# Altium project vme6U_carrier_Cyc_V_SoC.PrjPcb (part 3 of 8)

## Sheet ethernet_1gbe_ext_magn.SchDoc
size A4
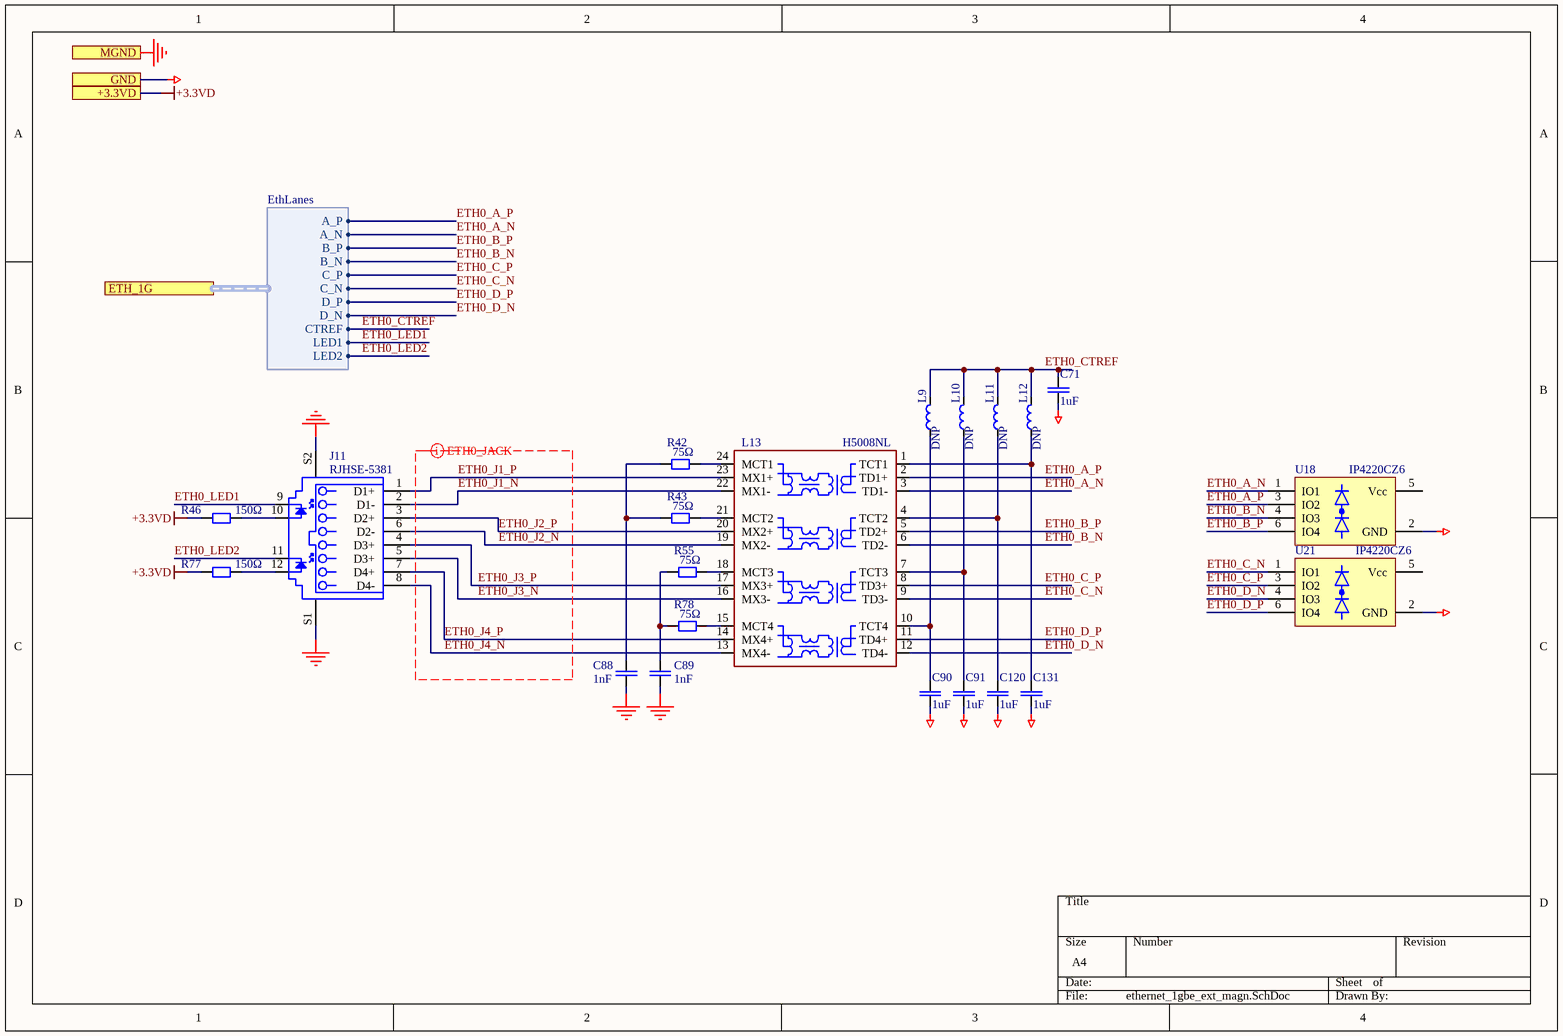
[diagram p4: ethernet_1gbe_ext_magn.SchDoc]

### Parts
(Parts that share a designator on the sheet are numbered #1, #2 ... from top to bottom, then left to right.)
C71  1uF  [CAPC2012N]
C88#1  value 1nF  [CAPC3216N]  (hidden comment: 1nF; 2kV)
C89  value 1nF  [CAPC3216N]  (hidden comment: 1nF; 2kV)
C90  1uF  [CAPC2012N]
C91#1  1uF  [CAPC2012N]
C120#1  1uF  [CAPC2012N]
C131  1uF  [CAPC2012N]
J11  RJHSE-5381  [AMPH-RJHSE-5381_V]
L9  DNP  [INDC2012N]
L10  DNP  [INDC2012N]
L11  DNP  [INDC2012N]
L12  DNP  [INDC2012N]
L13  H5008NL  [SMD_HX508]
R42  75Ω  [RESC2012N]
R43  75Ω  [RESC2012N]
R46  150Ω  [RESC2012N]
R55  75Ω  [RESC2012N]
R77  150Ω  [RESC2012N]
R78#1  75Ω  [RESC2012N]
U18  IP4220CZ6  [SOT95P285X110-6N]
U21#1  IP4220CZ6  [SOT95P285X110-6N]

### Ports
+3.3VD, ETH_1G (harness EthLanes), GND, MGND

### Harnesses
EthLanes: A_P, A_N, B_P, B_N, C_P, C_N, D_P, D_N, LED1, LED2, CTREF

### Nets
+3.3VD: R46.1 R77.1 ; port +3.3VD
GND: C71.1 C90.1 C91#1.1 C120#1.1 C131.1 U18.2(GND) U21#1.2(GND) ; port GND  [project net POK_int]
MGND: C88#1.1 C89.1 J11.S1 J11.S2 ; port MGND
ETH0_A_N: L13.3(TD1-) U18.1(IO1) ; port ETH_1G.A_N
ETH0_A_P: L13.2(TD1+) U18.3(IO2) ; port ETH_1G.A_P
ETH0_B_N: L13.6(TD2-) U18.4(IO3) ; port ETH_1G.B_N
ETH0_B_P: L13.5(TD2+) U18.6(IO4) ; port ETH_1G.B_P
ETH0_C_N: L13.9(TD3-) U21#1.1(IO1) ; port ETH_1G.C_N
ETH0_C_P: L13.8(TD3+) U21#1.3(IO2) ; port ETH_1G.C_P
ETH0_CTREF: C71.2 L9.2 L10.2 L11.2 L12.2 ; port ETH_1G.CTREF
ETH0_D_N: L13.12(TD4-) U21#1.4(IO3) ; port ETH_1G.D_N
ETH0_D_P: L13.11(TD4+) U21#1.6(IO4) ; port ETH_1G.D_P
ETH0_J1_N: J11.2(D1-) L13.22(MX1-)
ETH0_J1_P: J11.1(D1+) L13.23(MX1+)
ETH0_J2_N: J11.6(D2-) L13.19(MX2-)
ETH0_J2_P: J11.3(D2+) L13.20(MX2+)
ETH0_J3_N: J11.5(D3+) L13.16(MX3-)
ETH0_J3_P: J11.4(D3+) L13.17(MX3+)
ETH0_J4_N: J11.8(D4-) L13.13(MX4-)
ETH0_J4_P: J11.7(D4+) L13.14(MX4+)
ETH0_LED1: J11.9 ; port ETH_1G.LED1
ETH0_LED2: J11.11 ; port ETH_1G.LED2
NetC88#1_2: C88#1.2 R42.1 R43.1
NetC89_2: C89.2 R55.1 R78#1.1
NetC90_2: C90.2 L9.1 L13.10(TCT4)
NetC91#1_2: C91#1.2 L10.1 L13.7(TCT3)
NetC120#1_2: C120#1.2 L11.1 L13.4(TCT2)
NetC131_2: C131.2 L12.1 L13.1(TCT1)
NetJ11_10: J11.10 R46.2
NetJ11_12: J11.12 R77.2
NetL13_15: L13.15(MCT4) R78#1.2
NetL13_18: L13.18(MCT3) R55.2
NetL13_21: L13.21(MCT2) R43.2
NetL13_24: L13.24(MCT1) R42.2

Not connected (* = marked no-connect by the designer): U18 5(Vcc); U21#1 5(Vcc)

### Layout directives
differential pair; rule Differential Pairs Routing [Pref Gap = 0.254mm    Min Gap  = 0.075mm    Max Gap  = 0.254mmPref Width = 0.3mm    Min Width  = 0.075mm    Max Width  = 0.5mm]: ETH0_J1_N, ETH0_J1_P, ETH0_J2_N, ETH0_J2_P, ETH0_J3_N, ETH0_J3_P, ETH0_J4_N, ETH0_J4_P

### Library data of the parts
C71 C90 C91#1 C120#1 C131 = CAPC: Generic ceramic SMD capacitor; Pkg: 0805; Maintainer: Evgeniy Kotov; SMD Solders: 2; THD Solders: 0; Voltage Rating: 10V; PartField: 1uF; Last Change Data: 06.03.2017; Release Date: 06.03.2017; Value: 1uF
C88#1 = CAPC: Generic ceramic SMD capacitor / +' x '+Voltage Rating; Pkg: 1206; Maintainer: Evgeniy Kotov; SMD Solders: 2; THD Solders: 0; PartField: 1nF; Last Change Data: 06.03.2017; Release Date: 06.03.2017; VoltageRating: 2kV
C89 = CAPC: Generic ceramic SMD capacitor; Pkg: 1206; Maintainer: Evgeniy Kotov; SMD Solders: 2; THD Solders: 0; PartField: 1nF; Last Change Data: 06.03.2017; Release Date: 06.03.2017; VoltageRating: 2kV
J11 = RJ45-RJHSE-5381: High Speed RJ45, Modular Jack, 8 Position, 8 Contacts, Shielded, with LEDs, -55 to 85 degC,12-Pin THD, RoHS, Tray; Manufacturer: Amphenol; Number of Positions/Contacts: 8p8c(RJ45,Ethernet); Number of Ports: 1; Catalog Drawings: RJ45SeriesRightAngle; PCN Design/Specification: MultipleSeriesCopper29/Jan/2009RJHSEShieldMaterial30/Jun/2015; Other Names: RJHSE5381; Online Catalog: RJHSESeries; Featured Product: ModularJacksProductSolutions; Tab Direction: Up; Shielding: Shielded,EMIFinger; LED Color: Yellow-Green; 3D Model: RJHSE538x.stpRJHSE538x.igs; Pkg: LAN conn; SMD Solders: 0; THD Solders: 14; Category: Connectors,Interconnects; Termination: Solder; Housing Material: Thermoplastic; Mounting Type: ThroughHole; Family: ModularConnectors-Jacks; Orientation: 90°Angle(Right); Features: BoardLock; Contact Material: PhosphorBronze; Mounting Technology: ThroughHole; Number of Rows: 1; Standard Package: 120; Ratings: -; Operating Temperature: -55°C~85°C; Series: RJHSE; Contact Finish: Gold; Package Reference: RJHSE-5381; Ingress Protection: -; Package Description: 12-Pin Through Hole Device, Body 16.51 x 15.75 mm; Contact Finish Thickness: 50µin(1.27µm); Datasheet URL: https://datasheet.ciiva.com/16481/rjhse538x-16481714.pdf; Datasheet Version: Rev. K, 04/2014; Connector Type: Jack; Manufacturer URL: http://www.amphenol.com/; Packaging: Tray; PartField: RJHSE-5381; Value: RJHSE-5381
L9-L12 = BLM21RK102SN1D: Ferrite Beads, 0805, 1 kOhm; Pkg: 0805; Vendor: Murata; Maintainer: Evgeniy Kotov; SMD Solders: 2; THD Solders: 0; DC Current: 200mA; Tolerance: 25%; DC Resistance: 500mΩ; PartField: BLM21RK102SN1D; Release Date: 30.03.2017; Last Change Data: 30.03.2017; Temperature Range: -55°C to +125°C; Value: DNP
L13 = LAN_1G_TR_H5008NL: LAN Transformer fog 1GbE, 12 coils, 4 pairs.; Vendor: Pulse Electronics; Maintainer: Evgeniy Kotov; SMD Solders: 2; THD Solders: 0; Tolerance: 2%; PartField: H5008NL; Pkg: H5008NL; Release Date: 31.03.2017; Last Change Data: 31.03.2017; Temperature Range: -25°C to +85°C; Value: H5008NL
R42 R43 R46 R55 R77 R78#1 = RESC: Resistor, Generic, SMD; Pkg: 0805; Maintainer: Evgeniy Kotov; SMD Solders: 2; THD Solders: 0; Release Date: 06.03.2017; Last Change Data: 09.03.2017
  R42 R43 R55 R78#1: PartField: 75Ω; Value: 75Ω
  R46 R77: PartField: 150Ω; Value: 150Ω
U18 U21#1 = IP4220CZ6: Transimpedance Amplifier; Selectable-Feedback Resistance; Pkg: SOT457; SMD Solders: 6; THD Solders: 0; Maintainer: Evgeniy Kotov; Vendor: NXP; PartField: IP4220CZ6; ComponentLink1URL: http://assets.nexperia.com/documents/data-sheet/IP4220CZ6.pdf; ComponentLink1Description: Datasheet; Last Change Date: 28.03.2017; Release Date: 28.03.2017; Value: IP4220CZ6

## Sheet ethernet_dual_100mbe_ext_magn.SchDoc
size A4
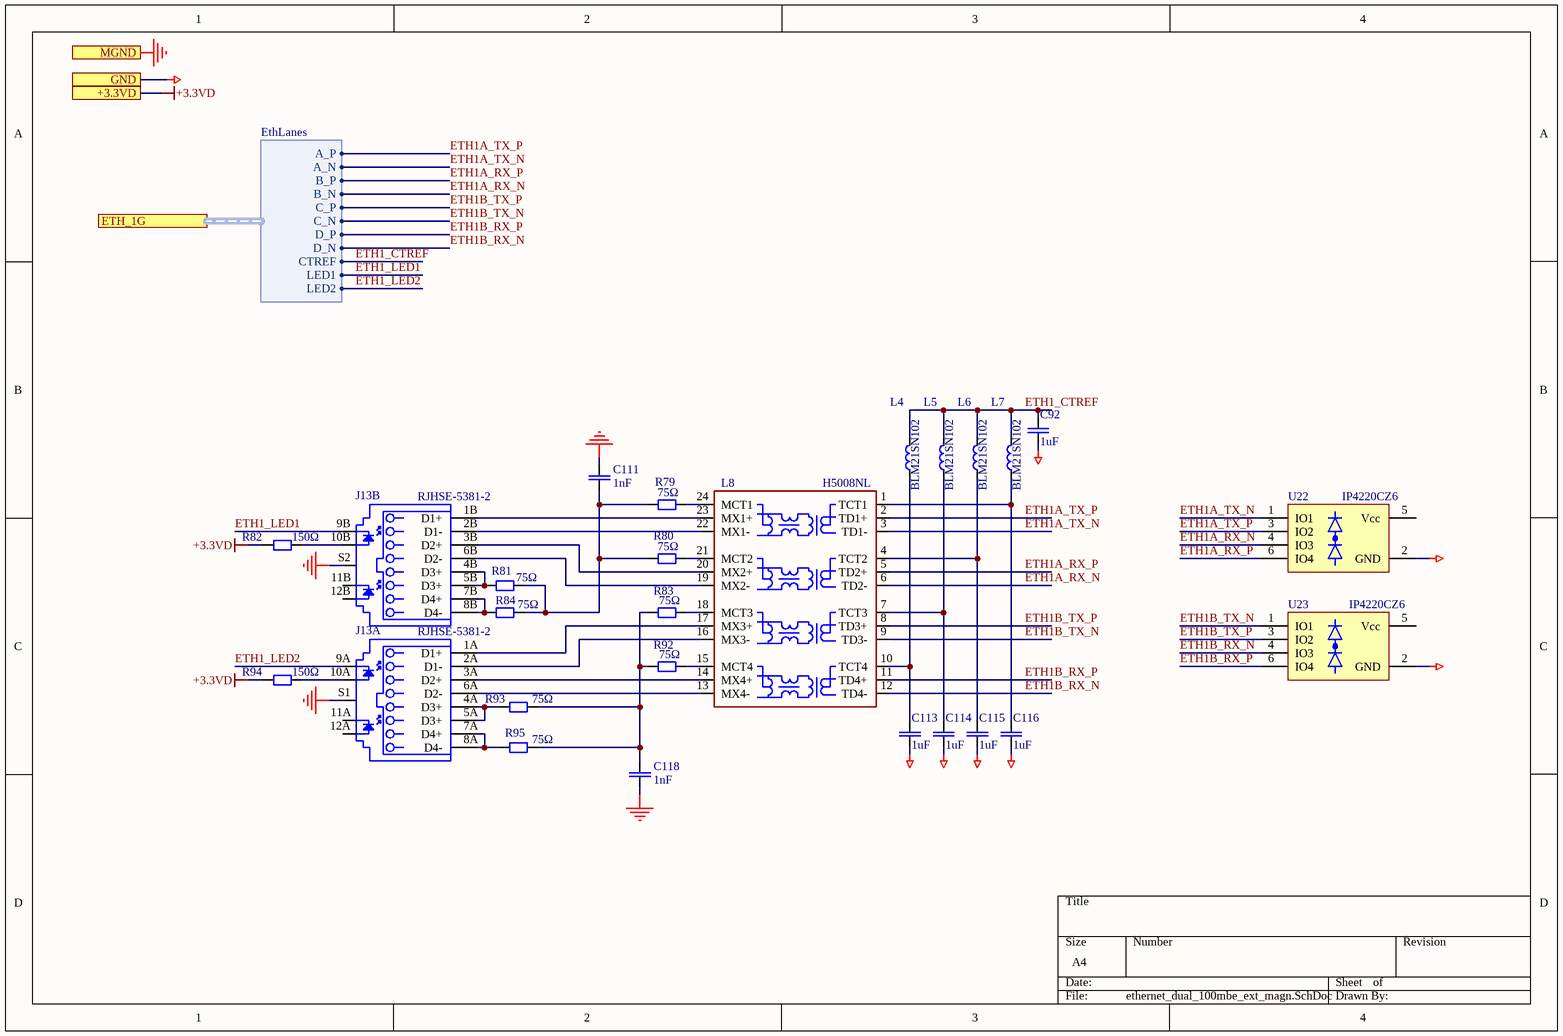
[diagram p5: ethernet_dual_100mbe_ext_magn.SchDoc]

### Parts
(Parts that share a designator on the sheet are numbered #1, #2 ... from top to bottom, then left to right.)
C92  1uF  [CAPC2012N]
C111  value 1nF  [CAPC3216N]  (hidden comment: 1nF; 2kV)
C113  1uF  [CAPC2012N]
C114  1uF  [CAPC2012N]
C115  1uF  [CAPC2012N]
C116  1uF  [CAPC2012N]
C118  value 1nF  [CAPC3216N]  (hidden comment: 1nF; 2kV)
J13  RJHSE-5381-2  [AMPH-RJHSE-5381-02_V]  (parts A,B of 2)
L4  value BLM21SN102  [INDC2012N]  (hidden comment: BLM21RK102SN1D)
L5  value BLM21SN102  [INDC2012N]  (hidden comment: BLM21RK102SN1D)
L6  value BLM21SN102  [INDC2012N]  (hidden comment: BLM21RK102SN1D)
L7  value BLM21SN102  [INDC2012N]  (hidden comment: BLM21RK102SN1D)
L8  H5008NL  [SMD_HX508]
R79  75Ω  [RESC2012N]
R80#1  75Ω  [RESC2012N]
R81  75Ω  [RESC2012N]
R82#1  150Ω  [RESC2012N]
R83#1  75Ω  [RESC2012N]
R84  75Ω  [RESC2012N]
R92#1  75Ω  [RESC2012N]
R93  75Ω  [RESC2012N]
R94  150Ω  [RESC2012N]
R95  75Ω  [RESC2012N]
U22  IP4220CZ6  [SOT95P285X110-6N]
U23  IP4220CZ6  [SOT95P285X110-6N]

### Ports
+3.3VD, ETH_1G (harness EthLanes), GND, MGND

### Harnesses
EthLanes: A_P, A_N, B_P, B_N, C_P, C_N, D_P, D_N, LED1, LED2, CTREF

### Nets
+3.3VD: R82#1.1 R94.1 ; port +3.3VD
GND: C92.1 C113.1 C114.1 C115.1 C116.1 U22.2(GND) U23.2(GND) ; port GND  [project net POK_int]
MGND: C111.2 C118.1 J13.S1 J13.S2 ; port MGND
ETH1_CTREF: C92.2 L4.2 L5.2 L6.2 L7.2 ; port ETH_1G.CTREF
ETH1_LED1: J13.9B ; port ETH_1G.LED1
ETH1_LED2: J13.9A ; port ETH_1G.LED2
ETH1A_RX_N: L8.6(TD2-) U22.4(IO3) ; port ETH_1G.B_N
ETH1A_RX_P: L8.5(TD2+) U22.6(IO4) ; port ETH_1G.B_P
ETH1A_TX_N: L8.3(TD1-) U22.1(IO1) ; port ETH_1G.A_N
ETH1A_TX_P: L8.2(TD1+) U22.3(IO2) ; port ETH_1G.A_P
ETH1B_RX_N: L8.12(TD4-) U23.4(IO3) ; port ETH_1G.D_N
ETH1B_RX_P: L8.11(TD4+) U23.6(IO4) ; port ETH_1G.D_P
ETH1B_TX_N: L8.9(TD3-) U23.1(IO1) ; port ETH_1G.C_N
ETH1B_TX_P: L8.8(TD3+) U23.3(IO2) ; port ETH_1G.C_P
NetC111_1: C111.1 R79.1 R80#1.1 R81.2 R84.2
NetC113_2: C113.2 L4.1 L8.10(TCT4)
NetC114_2: C114.2 L5.1 L8.7(TCT3)
NetC115_2: C115.2 L6.1 L8.4(TCT2)
NetC116_2: C116.2 L7.1 L8.1(TCT1)
NetC118_2: C118.2 R83#1.1 R92#1.1 R93.2 R95.2
NetJ13_1A: J13.1A(D1+) L8.17(MX3+)
NetJ13_1B: J13.1B(D1+) L8.23(MX1+)
NetJ13_2A: J13.2A(D1-) L8.16(MX3-)
NetJ13_2B: J13.2B(D1-) L8.22(MX1-)
NetJ13_3A: J13.3A(D2+) L8.14(MX4+)
NetJ13_3B: J13.3B(D2+) L8.20(MX2+)
NetJ13_4A: J13.4A(D3+) J13.5A(D3+) R93.1
NetJ13_4B: J13.4B(D3+) J13.5B(D3+) R81.1
NetJ13_6A: J13.6A(D2-) L8.13(MX4-)
NetJ13_6B: J13.6B(D2-) L8.19(MX2-)
NetJ13_7A: J13.7A(D4+) J13.8A(D4-) R95.1
NetJ13_7B: J13.7B(D4+) J13.8B(D4-) R84.1
NetJ13_10A: J13.10A R94.2
NetJ13_10B: J13.10B R82#1.2
NetL8_15: L8.15(MCT4) R92#1.2
NetL8_18: L8.18(MCT3) R83#1.2
NetL8_21: L8.21(MCT2) R80#1.2
NetL8_24: L8.24(MCT1) R79.2

Not connected (* = marked no-connect by the designer): J13 11A(11) 11B(11) 12A(12) 12B(12); U22 5(Vcc); U23 5(Vcc)

### Library data of the parts
C92 C113-C116 = CAPC: as C71 on sheet ethernet_1gbe_ext_magn; PartField: 1uF; Last Change Data: 06.03.2017; Release Date: 06.03.2017; Value: 1uF
C111 C118 = CAPC: as C89 on sheet ethernet_1gbe_ext_magn; PartField: 1nF; Last Change Data: 06.03.2017; Release Date: 06.03.2017; VoltageRating: 2kV
J13 = RJ45-RJHSE-5381-2: Dual Port, High Speed RJ45, Modular Jack, 8 Position, 8 Contacts, Shielded, with LEDs, -55 to 85 degC,12-Pin THD, RoHS, Tray; Manufacturer: Amphenol; Number of Positions/Contacts: 8p8c(RJ45,Ethernet); Number of Ports: 1; Catalog Drawings: RJ45SeriesRightAngle; PCN Design/Specification: MultipleSeriesCopper29/Jan/2009RJHSEShieldMaterial30/Jun/2015; Other Names: RJHSE5381; Online Catalog: RJHSESeries; Featured Product: ModularJacksProductSolutions; Tab Direction: Up; Shielding: Shielded,EMIFinger; LED Color: Yellow-Green; 3D Model: RJHSE538x.stpRJHSE538x.igs; Pkg: LAN x2; SMD Solders: 0; THD Solders: 28; Category: Connectors,Interconnects; Termination: Solder; Housing Material: Thermoplastic; Mounting Type: ThroughHole; Family: ModularConnectors-Jacks; Orientation: 90°Angle(Right); Features: BoardLock; Contact Material: PhosphorBronze; Mounting Technology: ThroughHole; Number of Rows: 1; Standard Package: 120; Ratings: -; Operating Temperature: -55°C~85°C; Series: RJHSE; Contact Finish: Gold; Package Reference: RJHSE-5381; Ingress Protection: -; Package Description: 12-Pin Through Hole Device, Body 16.51 x 15.75 mm; Contact Finish Thickness: 50µin(1.27µm); Datasheet URL: https://datasheet.ciiva.com/16481/rjhse538x-16481714.pdf; Datasheet Version: Rev. K, 04/2014; Connector Type: Jack; Manufacturer URL: http://www.amphenol.com/; Packaging: Tray; PartField: RJHSE-5381-2; Value: RJHSE-5381-2
L4-L7 = BLM21RK102SN1D: as L9 on sheet ethernet_1gbe_ext_magn; PartField: BLM21RK102SN1D; Release Date: 30.03.2017; Last Change Data: 30.03.2017; Temperature Range: -55°C to +125°C
L8 = LAN_1G_TR_H5008NL: as L13 on sheet ethernet_1gbe_ext_magn; PartField: H5008NL; Pkg: H5008NL; Release Date: 31.03.2017; Last Change Data: 31.03.2017; Temperature Range: -25°C to +85°C; Value: H5008NL
R79 R80#1 R81 R82#1 R83#1 R84 R92#1 R93-R95 = RESC: as R42 on sheet ethernet_1gbe_ext_magn; Release Date: 06.03.2017; Last Change Data: 09.03.2017
  R79 R80#1 R81 R83#1 R84 R92#1 R93 R95: PartField: 75Ω; Value: 75Ω
  R82#1 R94: PartField: 150Ω; Value: 150Ω
U22 U23 = IP4220CZ6: as U18 on sheet ethernet_1gbe_ext_magn; PartField: IP4220CZ6; ComponentLink1URL: http://assets.nexperia.com/documents/data-sheet/IP4220CZ6.pdf; ComponentLink1Description: Datasheet; Last Change Date: 28.03.2017; Release Date: 28.03.2017; Value: IP4220CZ6

## Sheet uart_adm3222.SchDoc
size A4
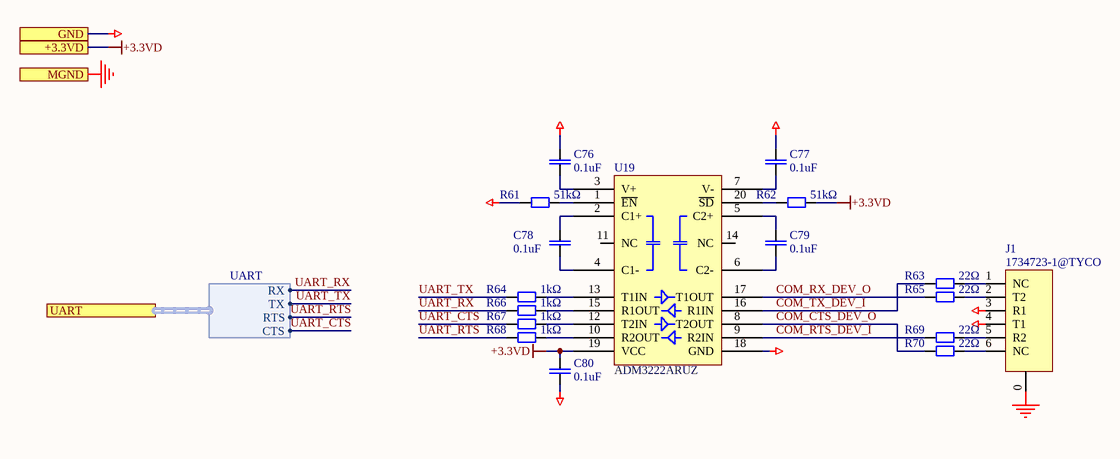
[diagram p6: uart_adm3222.SchDoc]

### Parts
(Parts that share a designator on the sheet are numbered #1, #2 ... from top to bottom, then left to right.)
C76#1  0.1uF  [CAPC2012N]
C77  0.1uF  [CAPC2012N]
C78  0.1uF  [CAPC2012N]
C79#1  0.1uF  [CAPC2012N]
C80  0.1uF  [CAPC2012N]
J1#1  1734723-1@TYCO  [RJ14]
R61  51kΩ  [RESC2012N]
R62  51kΩ  [RESC2012N]
R63  22Ω  [RESC1608N]
R64  1kΩ  [RESC2012N]
R65  22Ω  [RESC1608N]
R66  1kΩ  [RESC2012N]
R67#1  1kΩ  [RESC2012N]
R68  1kΩ  [RESC2012N]
R69  22Ω  [RESC1608N]
R70  22Ω  [RESC1608N]
U19#1  ADM3222ARUZ  [SOP65P640X110-20N]

### Ports
+3.3VD, GND, MGND, UART (harness UART)

### Harnesses
UART: RX, TX, RTS, CTS

### Nets
+3.3VD: C80.2 R62.2 U19#1.19(VCC) ; port +3.3VD
GND: C76#1.2 C77.2 C80.1 J1#1.3(R1) J1#1.4(T1) R61.1 U19#1.18(GND) ; port GND  [project net POK_int]
MGND: J1#1.0 ; port MGND
COM_CTS_DEV_O: R70.1 U19#1.8(T2OUT)
COM_RTS_DEV_I: R69.1 U19#1.9(R2IN)
COM_RX_DEV_O: R65.1 U19#1.17(T1OUT)
COM_TX_DEV_I: R63.1 U19#1.16(R1IN)
UART_CTS: R67#1.1 ; port UART.CTS
UART_RTS: R68.1 ; port UART.RTS
UART_RX: R66.1 ; port UART.RX
UART_TX: R64.1 ; port UART.TX
NetC76#1_1: C76#1.1 U19#1.3(V+)
NetC77_1: C77.1 U19#1.7(V-)
NetC78_1: C78.1 U19#1.4(C1-)
NetC78_2: C78.2 U19#1.2(C1+)
NetC79#1_1: C79#1.1 U19#1.6(C2-)
NetC79#1_2: C79#1.2 U19#1.5(C2+)
NetJ1#1_1: J1#1.1(NC) R63.2
NetJ1#1_2: J1#1.2(T2) R65.2
NetJ1#1_5: J1#1.5(R2) R69.2
NetJ1#1_6: J1#1.6(NC) R70.2
NetR61_2: R61.2 U19#1.1(~{EN})
NetR62_1: R62.1 U19#1.20(~{SD})
NetR64_2: R64.2 U19#1.13(T1IN)
NetR66_2: R66.2 U19#1.15(R1OUT)
NetR67#1_2: R67#1.2 U19#1.12(T2IN)
NetR68_2: R68.2 U19#1.10(R2OUT)

Not connected (* = marked no-connect by the designer): U19#1 11(NC) 14(NC)

### Library data of the parts
C76#1 C77 C78 C79#1 C80 = CAPC: Generic ceramic SMD capacitor; Pkg: 0805; Maintainer: Evgeniy Kotov; SMD Solders: 2; THD Solders: 0; PartField: 0.1uF; Last Change Data: 06.03.2017; Release Date: 06.03.2017; Value: 0.1uF
J1#1 = RJ-14: Pkg: RJ14-6p; SMD Solders: 0; THD Solders: 10; PartField: 1734723-1@TYCO; Value: 1734723-1@TYCO
R61 R62 R64 R66 R67#1 R68 = RESC: as R42 on sheet ethernet_1gbe_ext_magn; Release Date: 06.03.2017; Last Change Data: 09.03.2017
  R61 R62: PartField: 51kΩ; Value: 51kΩ
  R64 R66 R67#1 R68: PartField: 1kΩ; Value: 1kΩ
R63 R65 R69 R70 = RESC: Resistor, Generic, SMD; Pkg: 0603; Maintainer: Evgeniy Kotov; SMD Solders: 2; THD Solders: 0; PartField: 22Ω; Release Date: 06.03.2017; Last Change Data: 09.03.2017; Value: 22Ω
U19#1 = ADM3222ARU: RS232; Pkg: TSSOP-20; SMD Solders: 20; THD Solders: 0; Vendor: Analog Devices; ComponentLink1URL: https://www.analog.com/media/en/technical-documentation/data-sheets/ADM3202_3222_1385.pdf; Last Change Date: 24.05.2019; PartField: ADM3222ARUZ; Value: ADM3222

## Sheet jtag.SchDoc
size A4
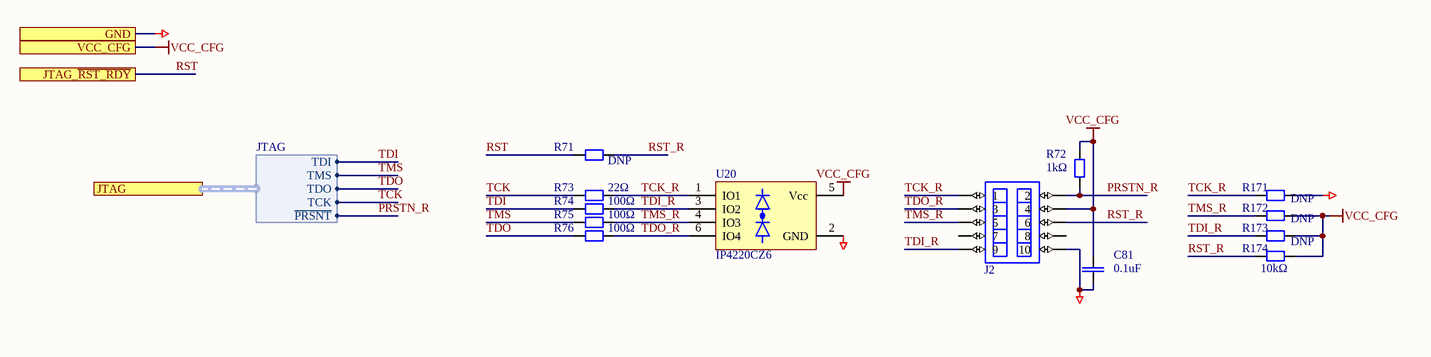
[diagram p7: jtag.SchDoc]

### Parts
(Parts that share a designator on the sheet are numbered #1, #2 ... from top to bottom, then left to right.)
C81#1  0.1uF  [CAPC2012N]
J2  IDC-10MC  [PLD-10]  (value not drawn)
R71  DNP  [RESC1608N]
R72  1kΩ  [RESC2012N]
R73  22Ω  [RESC1608N]
R74  100Ω  [RESC1608N]
R75  100Ω  [RESC1608N]
R76#1  100Ω  [RESC1608N]
R171  DNP  [RESC2012N]
R172  DNP  [RESC2012N]
R173#1  DNP  [RESC2012N]
R174  10kΩ  [RESC2012N]
U20  IP4220CZ6  [SOT95P285X110-6N]

### Ports
GND, JTAG (harness JTAG), JTAG_~{RST_RDY}, VCC_CFG

### Harnesses
JTAG: TDI, TMS, TDO, TCK, ~{PRSNT}

### Nets
GND: C81#1.1 J2.10 R171.2 U20.2(GND) ; port GND  [project net POK_int]
VCC_CFG: C81#1.2 J2.4 R72.2 R172.2 R173#1.2 R174.2 U20.5(Vcc) ; port VCC_CFG  [project net +3.3VD]
PRSTN_R: J2.2 R72.1 ; port JTAG.~{PRSNT}  [project net JTAG_~{PRSNT}]
RST: R71.1 ; port JTAG_~{RST_RDY}  [project net HPS_RSTn]
RST_R: J2.6 R71.2 R174.1
TCK: R73.1 ; port JTAG.TCK  [project net JTAG_TCK]
TCK_R: J2.1 R73.2 R171.1 U20.1(IO1)
TDI: R74.1 ; port JTAG.TDI  [project net JTAG_TDI]
TDI_R: J2.9 R74.2 R173#1.1 U20.3(IO2)
TDO: R76#1.1 ; port JTAG.TDO  [project net JTAG_TDO]
TDO_R: J2.3 R76#1.2 U20.6(IO4)
TMS: R75.1 ; port JTAG.TMS  [project net JTAG_TMS]
TMS_R: J2.5 R75.2 R172.1 U20.4(IO3)

Not connected (* = marked no-connect by the designer): J2 7 8

### Library data of the parts
C81#1 = CAPC: as C76#1 on sheet uart_adm3222; PartField: 0.1uF; Last Change Data: 06.03.2017; Release Date: 06.03.2017; Value: 0.1uF
J2 = IDC-10MS: Connector, 5x2, Male, 2.54mm Pitch, Strait contacts, with Body; SMD Solders: 0; THD Solders: 10; Maintainer: Evgeniy Kotov; Pkg: IDC-10; PartField: IDC-10MC; Last Change Data: 28.03.2017; Release Date: 28.03.2017; Value: IDC-10MC; ComponentLink1Description: Datasheet
R71 = RESC: Resistor, Generic, SMD; PartField: 100Ω; Pkg: 0603; Maintainer: Evgeniy Kotov; SMD Solders: 2; THD Solders: 0; Release Date: 06.03.2017; Last Change Data: 09.03.2017; Value: DNP
R72 R174 = RESC: as R42 on sheet ethernet_1gbe_ext_magn; Release Date: 06.03.2017; Last Change Data: 09.03.2017
  R72: PartField: 1kΩ; Value: 1kΩ
  R174: PartField: 10kΩ; Value: 10kΩ
R73-R75 R76#1 = RESC: as R63 on sheet uart_adm3222; Release Date: 06.03.2017; Last Change Data: 09.03.2017
  R73: PartField: 22Ω; Value: 22Ω
  R74 R75 R76#1: PartField: 100Ω; Value: 100Ω
R171 = RESC: Resistor, Generic, SMD; PartField: 1kΩ; Pkg: 0805; Maintainer: Evgeniy Kotov; SMD Solders: 2; THD Solders: 0; Release Date: 06.03.2017; Last Change Data: 09.03.2017; Value: DNP
R172 R173#1 = RESC: Resistor, Generic, SMD; PartField: 10kΩ; Pkg: 0805; Maintainer: Evgeniy Kotov; SMD Solders: 2; THD Solders: 0; Release Date: 06.03.2017; Last Change Data: 09.03.2017; Value: DNP
U20 = IP4220CZ6: as U18 on sheet ethernet_1gbe_ext_magn; PartField: IP4220CZ6; ComponentLink1URL: http://assets.nexperia.com/documents/data-sheet/IP4220CZ6.pdf; ComponentLink1Description: Datasheet; Last Change Date: 28.03.2017; Release Date: 28.03.2017; Value: IP4220CZ6

## Sheet sdcard_emmc.SchDoc
size A4
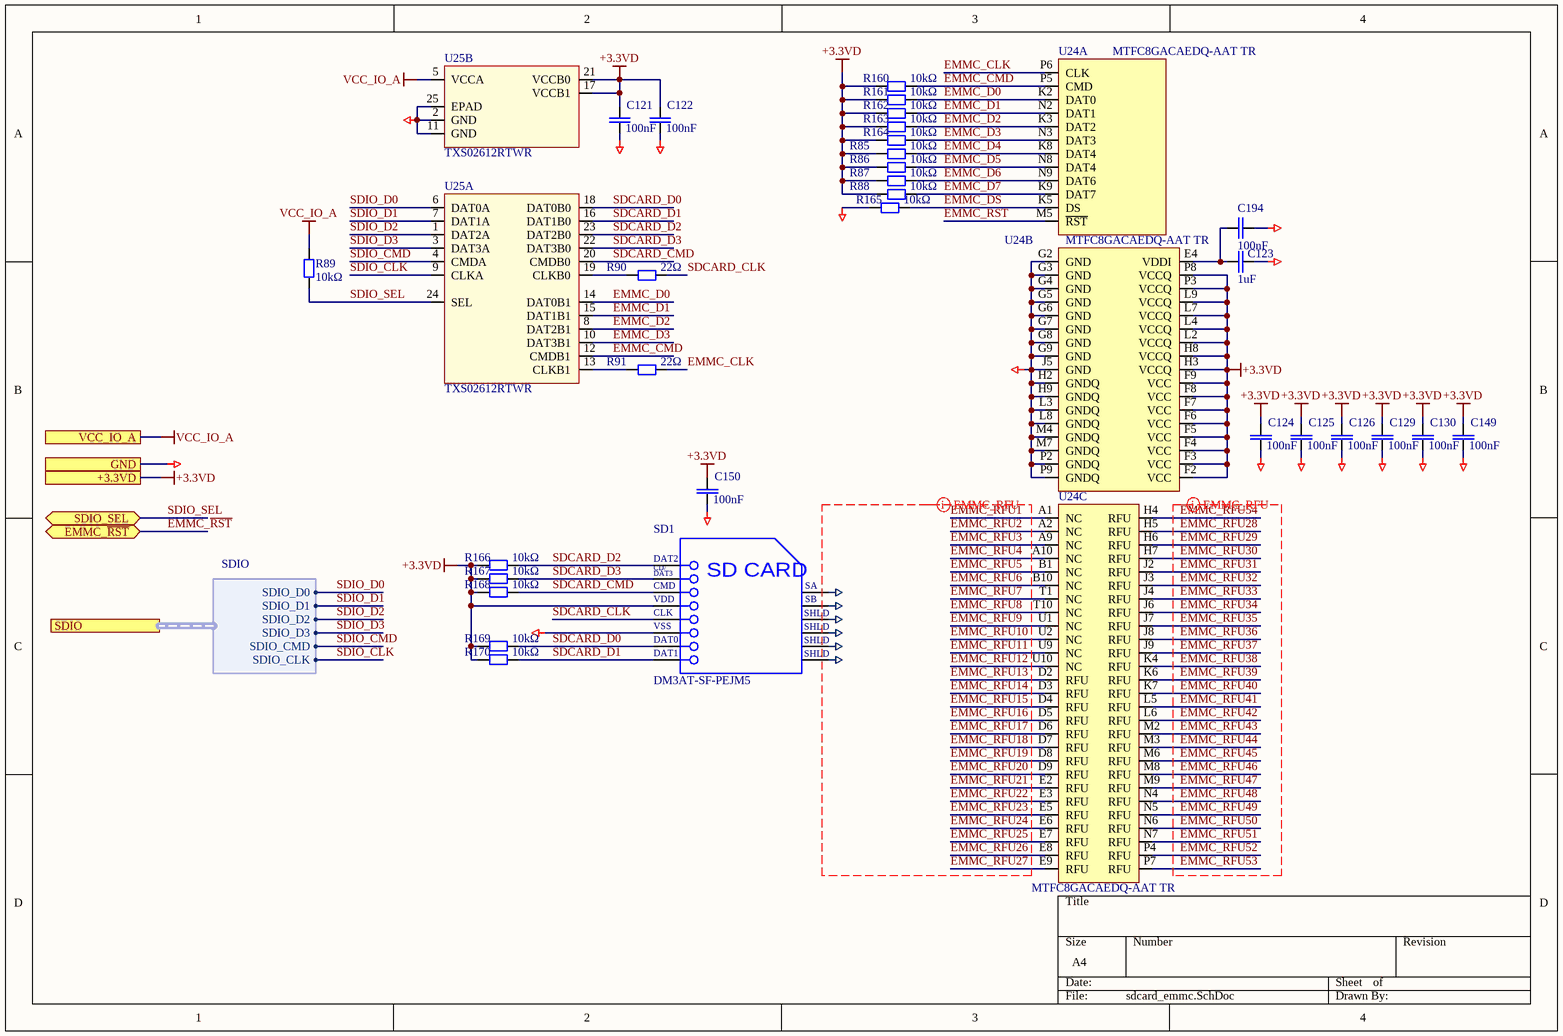
[diagram p8: sdcard_emmc.SchDoc]

### Parts
(Parts that share a designator on the sheet are numbered #1, #2 ... from top to bottom, then left to right.)
C121  100nF  [CAPC1608N]
C122#1  100nF  [CAPC1608N]
C123  1uF  [CAPC2012N]
C124  100nF  [CAPC1608N]
C125#1  100nF  [CAPC1608N]
C126  100nF  [CAPC1608N]
C129#1  100nF  [CAPC1608N]
C130  100nF  [CAPC1608N]
C149#1  100nF  [CAPC1608N]
C150  100nF  [CAPC1608N]
C194#1  100nF  [CAPC1608N]
R85  10kΩ  [RESC2012N]
R86#1  10kΩ  [RESC2012N]
R87#1  10kΩ  [RESC2012N]
R88  10kΩ  [RESC2012N]
R89#1  10kΩ  [RESC2012N]
R90  22Ω  [RESC1608N]
R91  22Ω  [RESC1608N]
R160  10kΩ  [RESC2012N]
R161  10kΩ  [RESC2012N]
R162  10kΩ  [RESC2012N]
R163  10kΩ  [RESC2012N]
R164  10kΩ  [RESC2012N]
R165  10kΩ  [RESC2012N]
R166  10kΩ  [RESC2012N]
R167  10kΩ  [RESC2012N]
R168#1  10kΩ  [RESC2012N]
R169  10kΩ  [RESC2012N]
R170  10kΩ  [RESC2012N]
SD1  DM3AT-SF-PEJM5  [SD_HRS-DM3AT-8_V]
U24#1  MTFC8GACAEDQ-AAT TR  [BGA100C100P10X17_1400X1800X120]  (parts A,B,C of 3)
U25  TXS02612RTWR  [QFN50P400X400X80-25N-S245]  (parts A,B of 2)

### Ports
+3.3VD, EMMC_~{RST} (bidir), GND, SDIO (harness SDIO), SDIO_SEL (bidir), VCC_IO_A

### Harnesses
SDIO: SDIO_D0, SDIO_D1, SDIO_D2, SDIO_D3, SDIO_CMD, SDIO_CLK

### Nets
+3.3VD: C121.1 C122#1.1 C124.1 C125#1.1 C126.1 C129#1.1 C130.1 C149#1.1 C150.1 R85.1 R86#1.1 R87#1.1 R88.1 R89#1.2 R160.1 R161.1 R162.1 R163.1 R164.1 R166.1 R167.1 R168#1.1 R169.1 R170.1 SD1.4(VDD) U24#1.F2(VCC) U24#1.F3(VCC) U24#1.F4(VCC) U24#1.F5(VCC) U24#1.F6(VCC) U24#1.F7(VCC) U24#1.F8(VCC) U24#1.F9(VCC) U24#1.H3(VCCQ) U24#1.H8(VCCQ) U24#1.L2(VCCQ) U24#1.L4(VCCQ) U24#1.L7(VCCQ) U24#1.L9(VCCQ) U24#1.P3(VCCQ) U24#1.P8(VCCQ) U25.5(VCCA) U25.17(VCCB1) U25.21(VCCB0) ; port +3.3VD, port VCC_IO_A  [also labelled VCC_IO_A]
GND: C121.2 C122#1.2 C123.1 C124.2 C125#1.2 C126.2 C129#1.2 C130.2 C149#1.2 C150.2 C194#1.2 R165.1 SD1.6(VSS) U24#1.G2(GND) U24#1.G3(GND) U24#1.G4(GND) U24#1.G5(GND) U24#1.G6(GND) U24#1.G7(GND) U24#1.G8(GND) U24#1.G9(GND) U24#1.H2(GNDQ) U24#1.H9(GNDQ) U24#1.J5(GND) U24#1.L3(GNDQ) U24#1.L8(GNDQ) U24#1.M4(GNDQ) U24#1.M7(GNDQ) U24#1.P2(GNDQ) U24#1.P9(GNDQ) U25.2(GND) U25.11(GND) U25.25(EPAD) ; port GND  [project net POK_int]
SDEPAD1: SD1.9(SA)
SDEPAD2: SD1.10(SB)
SDEPAD3: SD1.11(SHLD)
SDEPAD4: SD1.13(SHLD)
SDEPAD5: SD1.12(SHLD)
SDEPAD6: SD1.14(SHLD)
EMMC_CLK: R91.2 U24#1.P6(CLK)
EMMC_CMD: R160.2 U24#1.P5(CMD) U25.12(CMDB1)
EMMC_D0: R161.2 U24#1.K2(DAT0) U25.14(DAT0B1)
EMMC_D1: R162.2 U24#1.N2(DAT1) U25.15(DAT1B1)
EMMC_D2: R163.2 U24#1.K3(DAT2) U25.8(DAT2B1)
EMMC_D3: R164.2 U24#1.N3(DAT3) U25.10(DAT3B1)
EMMC_D4: R85.2 U24#1.K8(DAT4)
EMMC_D5: R86#1.2 U24#1.N8(DAT4)
EMMC_D6: R87#1.2 U24#1.N9(DAT6)
EMMC_D7: R88.2 U24#1.K9(DAT7)
EMMC_DS: R165.2 U24#1.K5(DS)
EMMC_~{RST}: U24#1.M5(~{RST}) ; port EMMC_~{RST}  [project net HPS_PORn]
EMMC_RFU1: U24#1.A1(NC)
EMMC_RFU2: U24#1.A2(NC)
EMMC_RFU3: U24#1.A9(NC)
EMMC_RFU4: U24#1.A10(NC)
EMMC_RFU5: U24#1.B1(NC)
EMMC_RFU6: U24#1.B10(NC)
EMMC_RFU7: U24#1.T1(NC)
EMMC_RFU8: U24#1.T10(NC)
EMMC_RFU9: U24#1.U1(NC)
EMMC_RFU10: U24#1.U2(NC)
EMMC_RFU11: U24#1.U9(NC)
EMMC_RFU12: U24#1.U10(NC)
EMMC_RFU13: U24#1.D2(RFU)
EMMC_RFU14: U24#1.D3(RFU)
EMMC_RFU15: U24#1.D4(RFU)
EMMC_RFU16: U24#1.D5(RFU)
EMMC_RFU17: U24#1.D6(RFU)
EMMC_RFU18: U24#1.D7(RFU)
EMMC_RFU19: U24#1.D8(RFU)
EMMC_RFU20: U24#1.D9(RFU)
EMMC_RFU21: U24#1.E2(RFU)
EMMC_RFU22: U24#1.E3(RFU)
EMMC_RFU23: U24#1.E5(RFU)
EMMC_RFU24: U24#1.E6(RFU)
EMMC_RFU25: U24#1.E7(RFU)
EMMC_RFU26: U24#1.E8(RFU)
EMMC_RFU27: U24#1.E9(RFU)
EMMC_RFU28: U24#1.H5(RFU)
EMMC_RFU29: U24#1.H6(RFU)
EMMC_RFU30: U24#1.H7(RFU)
EMMC_RFU31: U24#1.J2(RFU)
EMMC_RFU32: U24#1.J3(RFU)
EMMC_RFU33: U24#1.J4(RFU)
EMMC_RFU34: U24#1.J6(RFU)
EMMC_RFU35: U24#1.J7(RFU)
EMMC_RFU36: U24#1.J8(RFU)
EMMC_RFU37: U24#1.J9(RFU)
EMMC_RFU38: U24#1.K4(RFU)
EMMC_RFU39: U24#1.K6(RFU)
EMMC_RFU40: U24#1.K7(RFU)
EMMC_RFU41: U24#1.L5(RFU)
EMMC_RFU42: U24#1.L6(RFU)
EMMC_RFU43: U24#1.M2(RFU)
EMMC_RFU44: U24#1.M3(RFU)
EMMC_RFU45: U24#1.M6(RFU)
EMMC_RFU46: U24#1.M8(RFU)
EMMC_RFU47: U24#1.M9(RFU)
EMMC_RFU48: U24#1.N4(RFU)
EMMC_RFU49: U24#1.N5(RFU)
EMMC_RFU50: U24#1.N6(RFU)
EMMC_RFU51: U24#1.N7(RFU)
EMMC_RFU52: U24#1.P4(RFU)
EMMC_RFU53: U24#1.P7(RFU)
EMMC_RFU54: U24#1.H4(RFU)
SDCARD_CLK: R90.2 SD1.5(CLK)
SDCARD_CMD: R168#1.2 SD1.3(CMD) U25.20(CMDB0)
SDCARD_D0: R169.2 SD1.7(DAT0) U25.18(DAT0B0)
SDCARD_D1: R170.2 SD1.8(DAT1) U25.16(DAT1B0)
SDCARD_D2: R166.2 SD1.1(DAT2) U25.23(DAT2B0)
SDCARD_D3: R167.2 SD1.2(CD/DAT3) U25.22(DAT3B0)
SDIO_CLK: U25.9(CLKA) ; port SDIO.SDIO_CLK
SDIO_CMD: U25.4(CMDA) ; port SDIO.SDIO_CMD
SDIO_D0: U25.6(DAT0A) ; port SDIO.SDIO_D0
SDIO_D1: U25.7(DAT1A) ; port SDIO.SDIO_D1
SDIO_D2: U25.1(DAT2A) ; port SDIO.SDIO_D2
SDIO_D3: U25.3(DAT3A) ; port SDIO.SDIO_D3
SDIO_SEL: R89#1.1 U25.24(SEL) ; port SDIO_SEL
NetC123_2: C123.2 C194#1.1 U24#1.E4(VDDI)
NetR90_1: R90.1 U25.19(CLKB0)
NetR91_1: R91.1 U25.13(CLKB1)

### Layout directives
differential pair; net class EMMC_RFU: EMMC_RFU1, EMMC_RFU2, EMMC_RFU3, EMMC_RFU4, EMMC_RFU5, EMMC_RFU6, EMMC_RFU7, EMMC_RFU8, EMMC_RFU9, EMMC_RFU10, EMMC_RFU11, EMMC_RFU12, EMMC_RFU13, EMMC_RFU14, EMMC_RFU15, EMMC_RFU16, EMMC_RFU17, EMMC_RFU18, EMMC_RFU19, EMMC_RFU20, EMMC_RFU21, EMMC_RFU22, EMMC_RFU23, EMMC_RFU24, EMMC_RFU25, EMMC_RFU26, EMMC_RFU27, EMMC_RFU28, EMMC_RFU29, EMMC_RFU30, EMMC_RFU31, EMMC_RFU32, EMMC_RFU33, EMMC_RFU34, EMMC_RFU35, EMMC_RFU36, EMMC_RFU37, EMMC_RFU38, EMMC_RFU39, EMMC_RFU40, EMMC_RFU41, EMMC_RFU42, EMMC_RFU43, EMMC_RFU44, EMMC_RFU45, EMMC_RFU46, EMMC_RFU47, EMMC_RFU48, EMMC_RFU49, EMMC_RFU50, EMMC_RFU51, EMMC_RFU52, EMMC_RFU53, EMMC_RFU54, SDEPAD1, SDEPAD2, SDEPAD3, SDEPAD4, SDEPAD5, SDEPAD6

### Notes on the sheet
- (in symbol DM3AT-SF-PEJM5) CD/; DAT3; SD CARD

### Library data of the parts
C121 C122#1 C124 C125#1 C126 C129#1 C130 C149#1 C150 C194#1 = CAPC: Generic ceramic SMD capacitor; Pkg: 0603; Maintainer: Evgeniy Kotov; SMD Solders: 2; THD Solders: 0; PartField: 100nF; Last Change Data: 06.03.2017; Release Date: 06.03.2017; Value: 100nF
C123 = CAPC: as C71 on sheet ethernet_1gbe_ext_magn; PartField: 1uF; Last Change Data: 06.03.2017; Release Date: 06.03.2017; Value: 1uF
R85 R86#1 R87#1 R88 R89#1 R160-R167 R168#1 R169 R170 = RESC: as R42 on sheet ethernet_1gbe_ext_magn; PartField: 10kΩ; Release Date: 06.03.2017; Last Change Data: 09.03.2017; Value: 10kΩ
R90 R91 = RESC: as R63 on sheet uart_adm3222; PartField: 22Ω; Release Date: 06.03.2017; Last Change Data: 09.03.2017; Value: 22Ω
SD1 = DM3AT-SF-PEJM5: Micro SD Card Connector, 0.5 A, 125 V, -25 to 85 degC, 8-Pin SMD, RoHS, Tape and Reel; Manufacturer: Hirose Electric; Featured Product: DM3ATSeries; HTML Datasheet: DM3SeriesmicroSD.html; Other Names: HR1964DKR; Connector Type: ConnectorandEjector; Insertion, Removal Method: PushIn,PushOut; Card Type: SecureDigital-microSD™; Online Catalog: DM3Series; Number of Positions: 10(8+2); Product Training Modules: DM3SeriesmicroSDCardSockets; Pkg: SD card hlder; SMD Solders: 14; THD Solders: 0; Manufacturer URL: https://www.hirose.com; Contact Finish: Gold; Family: MemoryConnectors-PCCardSockets; Package Reference: DM3AT-8; Category: Connectors,Interconnects; Features: Switch; Mounting Type: SurfaceMount,RightAngle; Datasheet Version: Jun-10; Package Description: 8-Pin Surface Mount Device, Body 16.15 x 13.85 mm, Pitch 1.1 mm; Standard Package: 1; Contact Finish Thickness: -; Datasheet URL: https://ciiva.com/datasheet-click-46418261?src=ciiva&sig=4019062a; Mounting Feature: Normal,Standard-Top; Series: DM3; Packaging: Digi-Reel; Package URL: https://www.hirose.com/product/en/download_file/key_name/DM3/category/Catalog/doc_file_id/49662/?file_category_id=4&item_id=195&is_series=1; Ejector Side: -; Value: DM3AT-SF-PEJM5; Vendor: Hirose Electric; PartField: DM3AT-SF-PEJM5
U24#1 = MTFC32GAKAENA: Pkg: LBGA-100; SMD Solders: 100; THD Solders: 0; Value: MTFC8GACAEDQ-AAT TR; PartField: MTFC8GACAEDQ-AAT TR
U25 = TXS02612_RTW_24: IC SDIO PORT EXPANDER AND LEVEL SHIFTER; Vendor: Texas Instruments; PACKAGE_DESIGNATOR: RTW; PIN_COUNT: 24; FAMILY_NAME: APPLICATION SPECIFIC (COMPACT FLASH, SD, MMC, I2C); INDUSTRY_STD_PKG_TYPE: QFN; Pkg: QFN-24EP; SMD Solders: 25; THD Solders: 0; Manufacturer_Part_Number: txs02612_rtw_24; GENERIC_PART_NUMBER: TXS02612RTWR; Datasheet URL: http://www.ti.com/lit/gpn/TXS02612; Manufacturer: Texas Instruments; RefDes: RefDes; Type: DEV; Value: TXS02612RTWR; PartField: TXS02612RTWR

## Sheet can_phy.SchDoc
size A4
Used 2 times, as channels U_can_phy, U_can_phy. Parts and nets are listed once, with the designators drawn on the sheet.
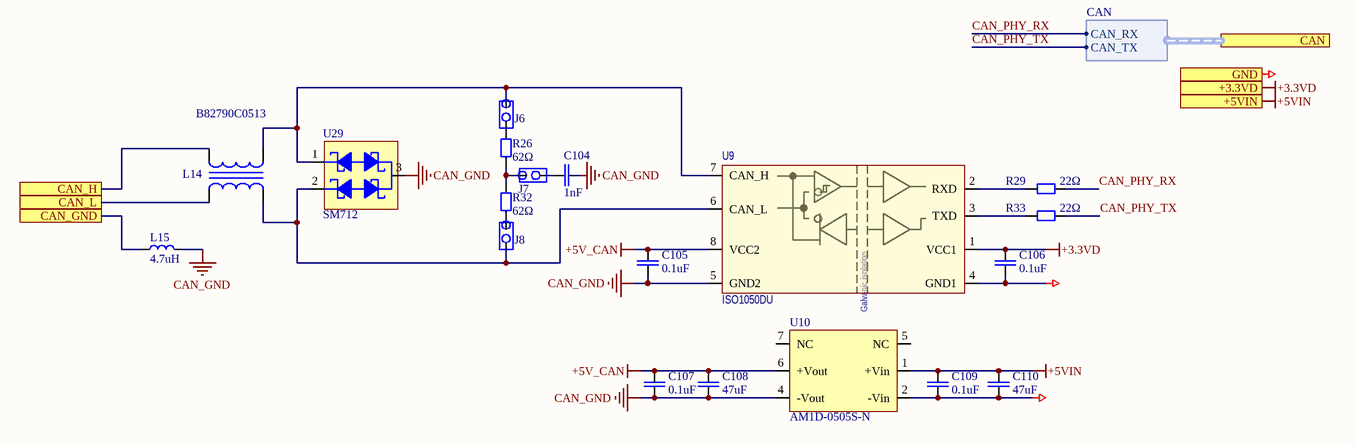
[diagram p9: can_phy.SchDoc]

### Parts
C104  value 1nF  [CAPC3216N]  (hidden comment: 1nF; 2kV)
C105  0.1uF  [CAPC2012N]
C106  0.1uF  [CAPC2012N]
C107  0.1uF  [CAPC2012N]
C108  47uF  [CAPC3216N]
C109  0.1uF  [CAPC2012N]
C110  47uF  [CAPC3216N]
J6  PLS-2  [PLS-2]  (value not drawn)
J7  PLS-2  [PLS-2]  (value not drawn)
J8  PLS-2  [PLS-2]  (value not drawn)
L14  B82790C0513  [SMD_B82790]
L15  value 4.7uH  [IND_3225_MURATA_LQH_N]  (hidden comment: LQH32PN4R7NN0L)
R26  62Ω  [RESC2012N]
R29  22Ω  [RESC1608N]
R32  62Ω  [RESC2012N]
R33  22Ω  [RESC1608N]
U9  ISO1050DU  [SOP8]
U10  AM1D-0505S-N  [SIP-7]
U29  SM712  [SOT95P240X110-3N]

### Ports
+3.3VD, +5VIN, CAN (harness CAN), CAN_GND, CAN_H, CAN_L, GND

### Harnesses
CAN: CAN_TX, CAN_RX

### Nets
+3.3VD: C106.2 U9.1(VCC1) ; port +3.3VD
+5V_CAN: C105.2 C107.2 C108.2 U9.8(VCC2) U10.6(+Vout)
+5VIN: C109.2 C110.2 U10.1(+Vin) ; port +5VIN
CAN_GND: C104.1 C105.1 C107.1 C108.1 L15.2 U9.5(GND2) U10.4(-Vout) U29.3
GND: C106.1 C109.1 C110.1 U9.4(GND1) U10.2(-Vin) ; port GND
CAN_GND: L15.1 ; port CAN_GND  [a separate net that carries the same name]
CAN_H: L14.1 ; port CAN_H
CAN_L: L14.4 ; port CAN_L
CAN_PHY_RX: R29.2 ; port CAN.CAN_RX
CAN_PHY_TX: R33.2 ; port CAN.CAN_TX
NetC104_2: C104.2 J7.2
NetJ6_1: J6.1 L14.2 U9.7(CAN_H) U29.1
NetJ6_2: J6.2 R26.2
NetJ7_1: J7.1 R26.1 R32.2
NetJ8_1: J8.1 R32.1
NetJ8_2: J8.2 L14.3 U9.6(CAN_L) U29.2
NetR29_1: R29.1 U9.2(RXD)
NetR33_1: R33.1 U9.3(TXD)

Not connected (* = marked no-connect by the designer): U10 5(NC) 7(NC)

### Channels
U_can_phy: designators end in _U_can_phy#1; ports +3.3VD=+3.3VD +5VIN=+5VME CAN_GND=CAN0_G CAN_H=CAN0_H CAN_L=CAN0_L GND=POK_int
U_can_phy: designators end in _U_can_phy#2; ports +3.3VD=+3.3VD +5VIN=+5VME CAN_GND=CAN1_G CAN_H=CAN1_H CAN_L=CAN1_L GND=POK_int

### Notes on the sheet
- (in symbol ISO1050DU) Galvanic isolation

### Library data of the parts
C104 = CAPC: as C89 on sheet ethernet_1gbe_ext_magn; PartField: 1nF; Last Change Data: 06.03.2017; Release Date: 06.03.2017; VoltageRating: 2kV
C105-C107 C109 = CAPC: as C76#1 on sheet uart_adm3222; PartField: 0.1uF; Last Change Data: 06.03.2017; Release Date: 06.03.2017; Value: 0.1uF
C108 C110 = CAPC: Generic ceramic SMD capacitor; Pkg: 1006; Maintainer: Evgeniy Kotov; SMD Solders: 2; THD Solders: 0; PartField: 47uF; Last Change Data: 06.03.2017; Release Date: 06.03.2017; Value: 47uF
J6-J8 = PLS-2: Connector, 5x2, Male, 2.54mm Pitch, Right Angle; SMD Solders: 0; THD Solders: 2; Maintainer: Evgeniy Kotov; PartField: PLS-2; Last Change Data: 02.04.2017; Release Date: 02.04.2017; Value: PLS-2; ComponentLink1Description: Datasheet; Pkg: PLS-2
L14 = B82790C0513: Pkg: SMD 4 pin; SMD Solders: 4; THD Solders: 0; Vendor: Epcos; PartField: B82790C0513; Value: B82790C0513
L15 = LQH32PN4R7NN0L: Inductor, Fixed, 1210, 4.7uH, 216mOhm, 1A, 30%; Pkg: 1210; Vendor: Murata; Maintainer: Evgeniy Kotov; SMD Solders: 2; THD Solders: 0; DC Current: 750mA; Tolerance: 20%; DC Resistance: 380mΩ; PartField: LQH32PN4R7NN0L; Release Date: 30.03.2017; Last Change Data: 30.03.2017; Temperature Range: -40°C to +105°C
R26 R32 = RESC: as R42 on sheet ethernet_1gbe_ext_magn; PartField: 62Ω; Release Date: 06.03.2017; Last Change Data: 09.03.2017; Value: 62Ω
R29 R33 = RESC: as R63 on sheet uart_adm3222; PartField: 22Ω; Release Date: 06.03.2017; Last Change Data: 09.03.2017; Value: 22Ω
U9 = ISO1050DU: Order: main; Pkg: SOP-8; SMD Solders: 8; THD Solders: 0; PartField: ISO1050DU; Value: ISO1050DU
U10 = AM1D-0505S-N: AM3G-0505DZ; Manufactuer: Aimtec; SolderOption: 0; Pkg: SIP-7pin; THD Solders: 7; HelpURL: http://www.aimtec.com/site/Aimtec/files/Datasheet/HighResolution/AM1D-NZ.pdf; Manufacturer: Aimtec; PartField: AM1D-0505S-N; Value: AM1D-0505S-N; Vendor: Aimtec; SMD Solders: 0
U29 = SM712: Pkg: SOT23-3; SMD Solders: 3; THD Solders: 0; Vendor: SemTech; ComponentLink1Description: Datasheet; ComponentLink1URL: https://static.chipdip.ru/lib/081/DOC001081416.pdf; Last Change Data: 05.03.2020; PartField: SM712; Value: SM712

## Sheet Power_3V3_LDO.SchDoc
size A4
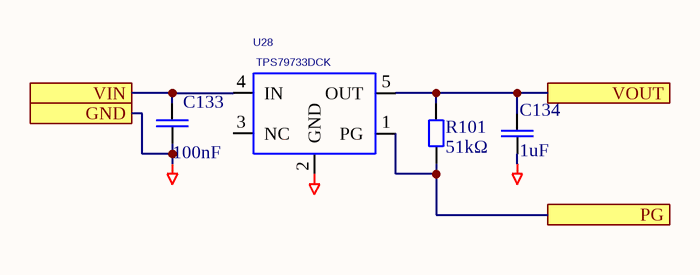
[diagram p10: Power_3V3_LDO.SchDoc]

### Parts
(Parts that share a designator on the sheet are numbered #1, #2 ... from top to bottom, then left to right.)
C133  100nF  [CAPC1608N]
C134  1uF  [CAPC2012N]
R101#1  51kΩ  [RESC2012N]
U28  TPS79733DCK  [SOT65P210X110-5N]

### Ports
GND, PG, VIN, VOUT

### Nets
+5VSTBY: C133.2 U28.4(IN) ; port VIN
GND: C133.1 C134.1 U28.2(GND) ; port GND  [project net POK_int]
3V3BATLDO: C134.2 R101#1.2 U28.5(OUT) ; port VOUT
NetR101#1_1: R101#1.1 U28.1(PG) ; port PG

Not connected (* = marked no-connect by the designer): U28 3(NC)

### Library data of the parts
C133 = CAPC: as C121 on sheet sdcard_emmc; PartField: 100nF; Last Change Data: 06.03.2017; Release Date: 06.03.2017; Value: 100nF
C134 = CAPC: as C71 on sheet ethernet_1gbe_ext_magn; PartField: 1uF; Last Change Data: 06.03.2017; Release Date: 06.03.2017; Value: 1uF
R101#1 = RESC: as R42 on sheet ethernet_1gbe_ext_magn; PartField: 51kΩ; Release Date: 06.03.2017; Last Change Data: 09.03.2017; Value: 51kΩ
U28 = TPS79733DCK: Ultra low power (Iq=1.2 mkA) LDO 3.3V Fixed; Vendor: Texas Instruments; PACKAGE_DESIGNATOR: MF; PIN_COUNT: 5; INDUSTRY_STD_PKG_TYPE: SC70-5; THD Solders: 0; Value: TPS79733DCK; Manufacturer_Part_Number: TPS79733DCK; GENERIC_PART_NUMBER: TPS79733DCK; FAMILY_NAME: LDO; HelpURL: http://www.ti.com/lit/ds/symlink/tps797.pdf; Manufacturer: Texas Instruments; Pkg: SC70-5; SMD Solders: 5; PartField: TPS79733DCK

## Sheet SFPplusConn.SchDoc
size A4
Used 4 times, as channels U_SFPplusConn_0, U_SFPplusConn_1, U_SFPplusConn_2, U_SFPplusConn_3. Parts and nets are listed once, with the designators drawn on the sheet.
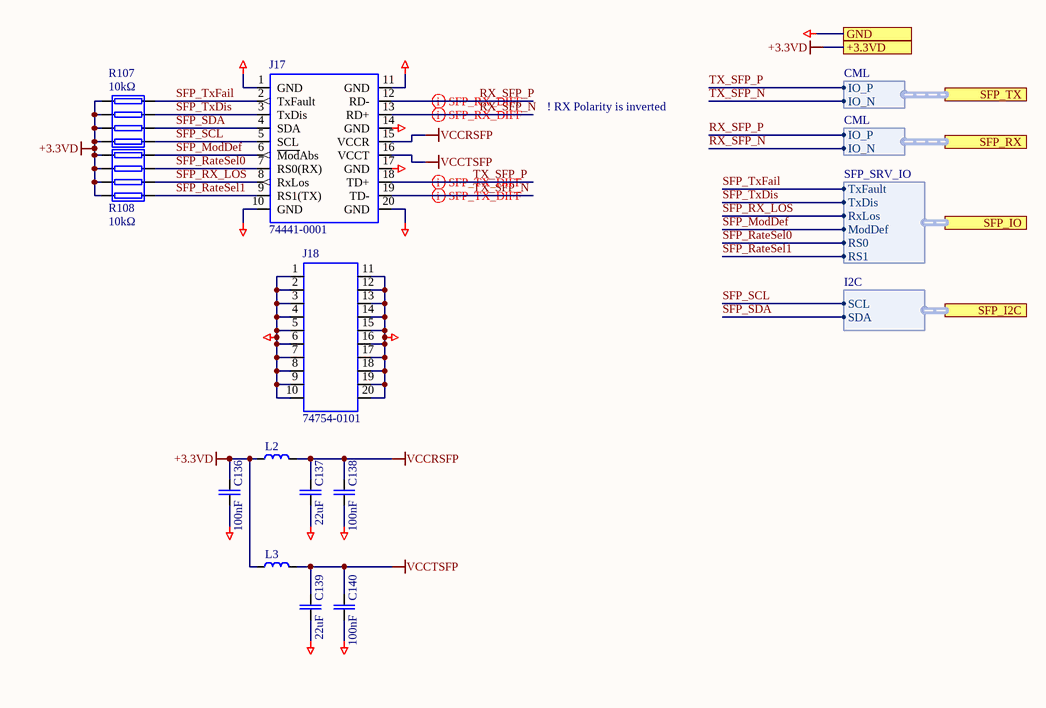
[diagram p11: SFPplusConn.SchDoc]

### Parts
C136  100nF  [CAPC1608N]
C137  22uF  [CAPC2012N]
C138  100nF  [CAPC1608N]
C139  22uF  [CAPC2012N]
C140  100nF  [CAPC1608N]
J17  74441-0001  [MOLEX_74441-0001]
J18  74754-0101  [MOLEX_74737-0111]
L2  BLM21PG221SN1  [INDC2012N]  (value not drawn)
L3  BLM21PG221SN1  [INDC2012N]  (value not drawn)
R107  value 10kΩ  [CAY16-J4]  (hidden comment: CAY16-1002F4LF)
R108  value 10kΩ  [CAY16-J4]  (hidden comment: CAY16-1002F4LF)

### Ports
+3.3VD, GND, SFP_I2C (harness I2C), SFP_IO (harness SFP_SRV_IO), SFP_RX (harness CML), SFP_TX (harness CML)

### Harnesses
CML: IO_N, IO_P
SFP_SRV_IO: TxDis, TxFault, RS0, RS1, ModDef, RxLos
I2C: SDA, SCL

### Nets
+3.3VD: C136.2 L2.1 L3.1 R107.1 R107.2 R107.3 R107.4 R108.1 R108.2 R108.3 R108.4 ; port +3.3VD
GND: C136.1 C137.1 C138.1 C139.1 C140.1 J17.1(GND) J17.10(GND) J17.11(GND) J17.14(GND) J17.17(GND) J17.20(GND) J18.1 J18.2 J18.3 J18.4 J18.5 J18.6 J18.7 J18.8 J18.9 J18.10 J18.11 J18.12 J18.13 J18.14 J18.15 J18.16 J18.17 J18.18 J18.19 J18.20 ; port GND
VCCRSFP: C137.2 C138.2 J17.15(VCCR) L2.2
VCCTSFP: C139.2 C140.2 J17.16(VCCT) L3.2
RX_SFP_N: J17.13(RD+) ; port SFP_RX.IO_N
RX_SFP_P: J17.12(RD-) ; port SFP_RX.IO_P
SFP_ModDef: J17.6(~{Mod}Abs) R108.8 ; port SFP_IO.ModDef
SFP_RateSel0: J17.7(RS0(RX)) R108.7 ; port SFP_IO.RS0
SFP_RateSel1: J17.9(RS1(TX)) R108.5 ; port SFP_IO.RS1
SFP_RX_LOS: J17.8(RxLos) R108.6 ; port SFP_IO.RxLos
SFP_SCL: J17.5(SCL) R107.5 ; port SFP_I2C.SCL
SFP_SDA: J17.4(SDA) R107.6 ; port SFP_I2C.SDA
SFP_TxDis: J17.3(TxDis) R107.7 ; port SFP_IO.TxDis
SFP_TxFail: J17.2(TxFault) R107.8 ; port SFP_IO.TxFault
TX_SFP_N: J17.19(TD-) ; port SFP_TX.IO_N
TX_SFP_P: J17.18(TD+) ; port SFP_TX.IO_P

### Channels
U_SFPplusConn_0: designators end in _U_SFPplusConn_0; ports +3.3VD=+3.3VD GND=POK_int
U_SFPplusConn_1: designators end in _U_SFPplusConn_1; ports +3.3VD=+3.3VD GND=POK_int
U_SFPplusConn_2: designators end in _U_SFPplusConn_2; ports +3.3VD=+3.3VD GND=POK_int
U_SFPplusConn_3: designators end in _U_SFPplusConn_3; ports +3.3VD=+3.3VD GND=POK_int

### Layout directives
differential pair; rule Differential Pairs Routing [Pref Gap = 0.175mm    Min Gap  = 0.075mm    Max Gap  = 0.5mmPref Width = 0.25mm    Min Width  = 0.075mm    Max Width  = 0.5mm]: SFP_RX_0.IO_N, SFP_RX_0.IO_P, SFP_TX_0.IO_N, SFP_TX_0.IO_P

### Notes on the sheet
- ! RX Polarity is inverted

### Library data of the parts
C136 C138 C140 = CAPC: as C121 on sheet sdcard_emmc; PartField: 100nF; Last Change Data: 06.03.2017; Release Date: 06.03.2017; Value: 100nF
C137 C139 = CAPC: as C76#1 on sheet uart_adm3222; PartField: 22uF; Last Change Data: 06.03.2017; Release Date: 06.03.2017; Value: 22uF
J17 = MOLEX-74441-0001: CONN SFP+ RCPT 20POS SLD R/A SMD; Pkg: SMD SFP conn; SMD Solders: 20; THD Solders: 0; RoHSCompliant: True; ComponentLink3URL: http://www.molex.com/pdm_docs/sd/747540101_sd.pdf; Width: 49 mm; Height: 10.85 mm; Mounting Technology: Through Hole; ComponentLink2Description: Datasheet; ComponentLink3Description: Package Specification; DatasheetVersion: Rev. Jul-15; Package Quantity: 1152; PackageDescription: CONN SFP+ RCPT 20POS SLD R/A SMD; Radiation Hardening: No; PackageVersion: Rev. J, 02/2015; ComponentLink1Description: Manufacturer URL; PartNumber: 74441-0001; ComponentLink1URL: http://www.molex.com/; Packaging: Tray; Length: 15.9 mm; ComponentLink2URL: http://www.molex.com/webdocs/datasheets/pdf/en-us/0747540101_IO_CONNECTORS.pdf; Value: 74441-0001; PartField: 74441-0001
J18 = MOLX-74754-0101: SFP+ Cage, Single Port, Height 10.85 mm, Tail Height 3.05 mm, -40 to 85 degC, RoHS, Tray; Pkg: SFP cage; SMD Solders: 0; THD Solders: 20; RoHSCompliant: True; ComponentLink3URL: http://www.molex.com/pdm_docs/sd/747540101_sd.pdf; Width: 49 mm; Height: 10.85 mm; Mounting Technology: Through Hole; ComponentLink2Description: Datasheet; ComponentLink3Description: Package Specification; DatasheetVersion: Rev. Jul-15; Package Quantity: 1152; PackageDescription: SFP+ Cage, Single Port, Height 10.85 mm, Tail Height 3.05 mm; Radiation Hardening: No; PackageVersion: Rev. J, 02/2015; ComponentLink1Description: Manufacturer URL; PartNumber: 74754-0101; ComponentLink1URL: http://www.molex.com/; Packaging: Tray; Length: 15.9 mm; ComponentLink2URL: http://www.molex.com/webdocs/datasheets/pdf/en-us/0747540101_IO_CONNECTORS.pdf; Value: 74754-0101; PartField: 74754-0101
L2 L3 = BLM21PG221SN1: Ferrite Beads, 0805, 220 Ohm, 2A; Pkg: 0805; Vendor: Murata; Maintainer: Evgeniy Kotov; SMD Solders: 2; THD Solders: 0; DC Current: 200mA; Tolerance: 25%; DC Resistance: 50mΩ; PartField: BLM21PG221SN1; Release Date: 30.03.2017; Last Change Data: 30.03.2017; Temperature Range: -55°C to +125°C; Value: BLM21PG221SN1
R107 R108 = RESPACK4: Maintainer: Anton Pavlenko; Pkg: SMD 8pin; SMD Solders: 8; THD Solders: 0; PartField: CAY16-1002F4LF; Last Change Data: 16.05.2019; Release Date: 16.05.2019